# Altium schematic sheet thermocouple.SchDoc
size A4
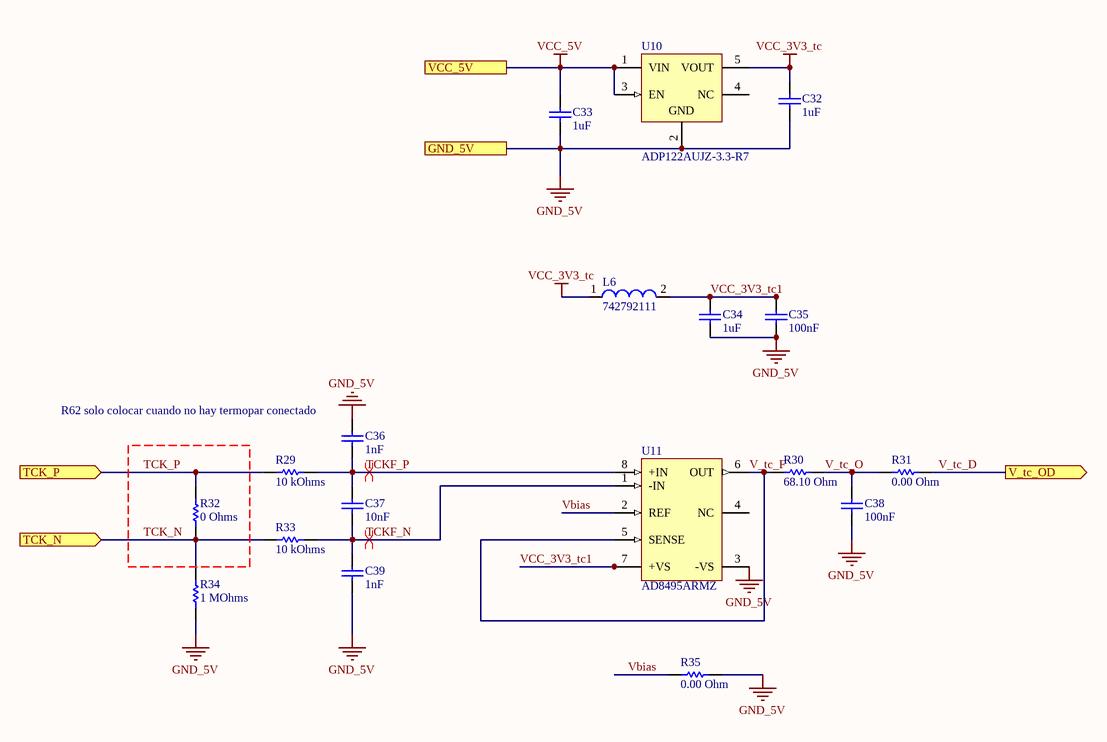
[diagram p0: thermocouple.SchDoc]

## Parts
C32  value 1uF  [CAPC0603(1608)100_N]  (hidden comment: CAP 1uF 50V 0603(1608))
C33  value 1uF  [CAPC0603(1608)100_N]  (hidden comment: CAP 1uF 50V 0603(1608))
C34  value 1uF  [CAPC0603(1608)100_L]  (hidden comment: CAP 1uF 50V 0603(1608))
C35  value 100nF  [CAPC0603(1608)100_L]  (hidden comment: CAP 100nF 50V 0603(1608))
C36  value 1nF  [CAPC0603(1608)100_L]  (hidden comment: CAP 1nF 25V 0603(1608))
C37  value 10nF  [CAPC0603(1608)100_L]  (hidden comment: CAP 10nF 25V 0603(1608))
C38  value 100nF  [CAPC0603(1608)100_N]  (hidden comment: CAP 100nF 10V 0603(1608))
C39  value 1nF  [CAPC0603(1608)100_L]  (hidden comment: CAP 1nF 25V 0603(1608))
L6  742792111  [SMD-1206]
R29  value 10 kOhms  [RESC3116X65X50NL20T20]  (hidden comment: CRCW120610K0FKEAHP)
R30  value 68.10 Ohm  [RESC0805(2012)_N]  (hidden comment: 68R1 1% 0805(2012))
R31  value 0.00 Ohm  [RESC0603(1608)_N]  (hidden comment: Jumper 0603(1608))
R32  value 0 Ohms  [RESC3216X60X45LL10T20]  (hidden comment: CRCW12060000Z0EB)
R33  value 10 kOhms  [RESC3116X65X50NL20T20]  (hidden comment: CRCW120610K0FKEAHP)
R34  value 1 MOhms  [RESC3216X70X50LL05T20]  (hidden comment: ERJ-8GEYJ105V)
R35  value 0.00 Ohm  [RESC0603(1608)_L]  (hidden comment: Jumper 0603(1608))
U10  ADP122AUJZ-3.3-R7  [ADI-UJ-5_L]
U11  AD8495ARMZ  [DGK0008A_L]

## Ports
GND_5V, TCK_N (in), TCK_P (in), V_tc_OD (out), VCC_5V

## Nets
GND_5V: C32.1 C33.1 C34.1 C35.1 C36.1 C38.1 C39.2 R34.1 R35.2 U10.2(GND) U11.3(-VS) ; port GND_5V
VCC_3V3_tc: C32.2 L6.1 U10.5(VOUT)
VCC_5V: C33.2 U10.1(VIN) U10.3(EN) ; port VCC_5V
TCK_N: R32.1 R33.2 R34.2 ; port TCK_N
TCK_P: R29.2 R32.2 ; port TCK_P
TCKF_N: C37.2 C39.1 R33.1 U11.1(-IN)
TCKF_P: C36.2 C37.1 R29.1 U11.8(+IN)
V_tc_D: R31.1 ; port V_tc_OD
V_tc_F: R30.2 U11.5(SENSE) U11.6(OUT)
V_tc_O: C38.2 R30.1 R31.2
Vbias: R35.1 U11.2(REF)
VCC_3V3_tc1: C34.2 C35.2 L6.2 U11.7(+VS)

Not connected (* = marked no-connect by the designer): U10 4(NC); U11 4(NC)

## Layout directives
differential pair: TCKF_N, TCKF_P

## Notes on the sheet
- (near C36) R62 solo colocar cuando no hay termopar conectado

## Library data of the parts
C32-C34 = CMP-1035-02746-1: CAP 1uF 50V ±20% 0603 (1608 Metric) Thickness 1mm SMD; Tolerance: Â±20%; Case-EIA: 0603; Case-Metric: 1608; Technology: SMT; Max Thickness: 1 mm; Rated Voltage: 50 V
C35 = CMP-1035-02591-1: CAP 100nF 50V ±5% 0603 (1608 Metric) Thickness 1mm SMD; Tolerance: Â±5%; Case-Metric: 1608; Case-EIA: 0603; Rated Voltage: 50 V; Max Thickness: 1 mm; Technology: SMT
C36 C39 = CMP-1035-01883-1: CAP 1nF 25V ±5% 0603 (1608 Metric) Thickness 1mm SMD; Case-EIA: 0603; Tolerance: Â±5%; Case-Metric: 1608; Technology: SMT; Rated Voltage: 25 V; Max Thickness: 1 mm
C37 = CMP-1035-02316-1: CAP 10nF 25V ±5% 0603 (1608 Metric) Thickness 1mm SMD; Tolerance: Â±5%; Case-EIA: 0603; Case-Metric: 1608; Rated Voltage: 25 V; Technology: SMT; Max Thickness: 1 mm
C38 = CMP-1035-02580-1: CAP 100nF 10V ±10% 0603 (1608 Metric) Thickness 1mm SMD; Tolerance: Â±10%; Case-EIA: 0603; Case-Metric: 1608; Max Thickness: 1 mm; Rated Voltage: 10 V; Technology: SMT
L6 = CMP-0220-00024-1: SMD EMI Suppression Ferrite Bead WE-CBF, Z = 26 Ohm; Impedance: 26 Ohm; ComponentLink2Description: Datasheet; PackageReference: SMD-1206; ComponentLink2URL: http://www.we-online.de/katalog/media/pdf/742792111.pdf; PackageVersion: 2007; DatasheetVersion: Dec-2005; PackageDescription: Chip Inductor, 2-Leads, Body 3.2 x 1.6 mm; ComponentLink1URL: http://www.we-online.com; ComponentLink1Description: Manufacturer Link
R29 R33 = CMP-2003-04883-1: Manufacturer: Vishay Dale; Precision: 1%; Part Number: CRCW120610K0FKEAHP; Package: 1206
R30 = CMP-1013-00379-1: 68R1 0.125W 1% 0805 (2012 Metric)  SMD; Case-EIA: 0805; Case-Metric: 2012; Power: 0.125 W; Tolerance: 1 %; Technology: SMT
R31 R35 = CMP-1012-00001-1: Jumper 0603 (1608 Metric); Case-Metric: 1608; Power: None; Case-EIA: 0603; Technology: SMT; Tolerance: None
R32 = CMP-2003-04797-1: Manufacturer: Vishay Dale; Part Number: CRCW12060000Z0EB; Package: 1206
R34 = CMP-2003-00547-1: Manufacturer: Panasonic; Precision: 5%; Part Number: ERJ-8GEYJ105V; Package: 1206
U10 = CMP-0786-00346-1: 300 mA, Low Quiescent Current, CMOS Linear Regulator, 2.3 to 5.5 V Vin, 3.3 V Vout, Industrial, 5-pin SOT23 (UJ-5), Reel; Manufacturer: Analog Devices; Vin (min) (V): 2.3; Supply Current IGND @ Small Load: 45uA; Vin (max) (V): 5.5; Iout max: 300mA; Preset Vout Values (V): 3.3; ComponentLink4Description: URL Link1; ComponentLink4URL: Product URL:http://www.analog.com/en/ADP122/productSearch.html; ComponentLink2URL: http://www.analog.com/static/imported-files/data_sheets/ADP122_123.pdf; PackageDescription: 5-Pin Thin Small Outline Transistor Package, Body 2.9 x 1.6 mm, Pitch 0.95 mm; ComponentLink1URL: http://www.analog.com/en/index.html; ComponentLink3URL: http:/www.analog.com/static/imported-files/packages/PKG_PDF/TSOT(UJ)/UJ_5.pdf; ComponentLink2Description: Datasheet; PartNumber: ADP122AUJZ-3.3-R7; Packing: Reel; ComponentLink1Description: Manufacturer URL; Code_JEDEC: MO-193-AB; PackageVersion: 100708-A, 10/2008; PackageReference: UJ-5; Mounting Technology: Surface Mount; DatasheetVersion: Rev. E; ComponentLink3Description: Package Specification
U11 = AD8495ARMZ: Full K-Type Thermocouple Amplifier with Cold Junction Compensation, Industrial, 8-pin SOP (RM-8), Tube; Manufacturer: Analog Devices; ComponentLink3URL: http://www.analog.com/static/imported-files/packages/PKG_PDF/MSOP%28RM%29/RM_8.pdf; ComponentLink4URL: http://www.analog.com/en/mems-sensors/digital-temperature-sensors/ad8495/products/product.html; ComponentLink1URL: http://www.analog.com/en/index.html; PartNumber: AD8495ARMZ; PackageVersion: 08/2005; PackageReference: RM-8; PackageDescription: 8-Pin Mini Small Outline Package, Body 3 x 3 mm, Pitch 0.65 mm; ComponentLink1Description: Manufacturer URL; Code_JEDEC: MO-187-AA; ComponentLink2URL: http://www.analog.com/static/imported-files/data_sheets/AD8494_8495_8496_8497.pdf; Mounting Technology: Surface Mount; ComponentLink4Description: Product URL; ComponentLink3Description: Package Specification; Packing: Tube; ComponentLink2Description: Datasheet; DatasheetVersion: Rev. C; Supplier 1: Digi-Key; Supplier 2: Arrow; Supplier 3: Mouser; Supplier 4: Farnell; Supplier Part Number 1: AD8495ARMZ-ND; Supplier Part Number 2: AD8495ARMZ; Supplier Part Number 3: 584-AD8495ARMZ; Supplier Part Number 4: 1864707